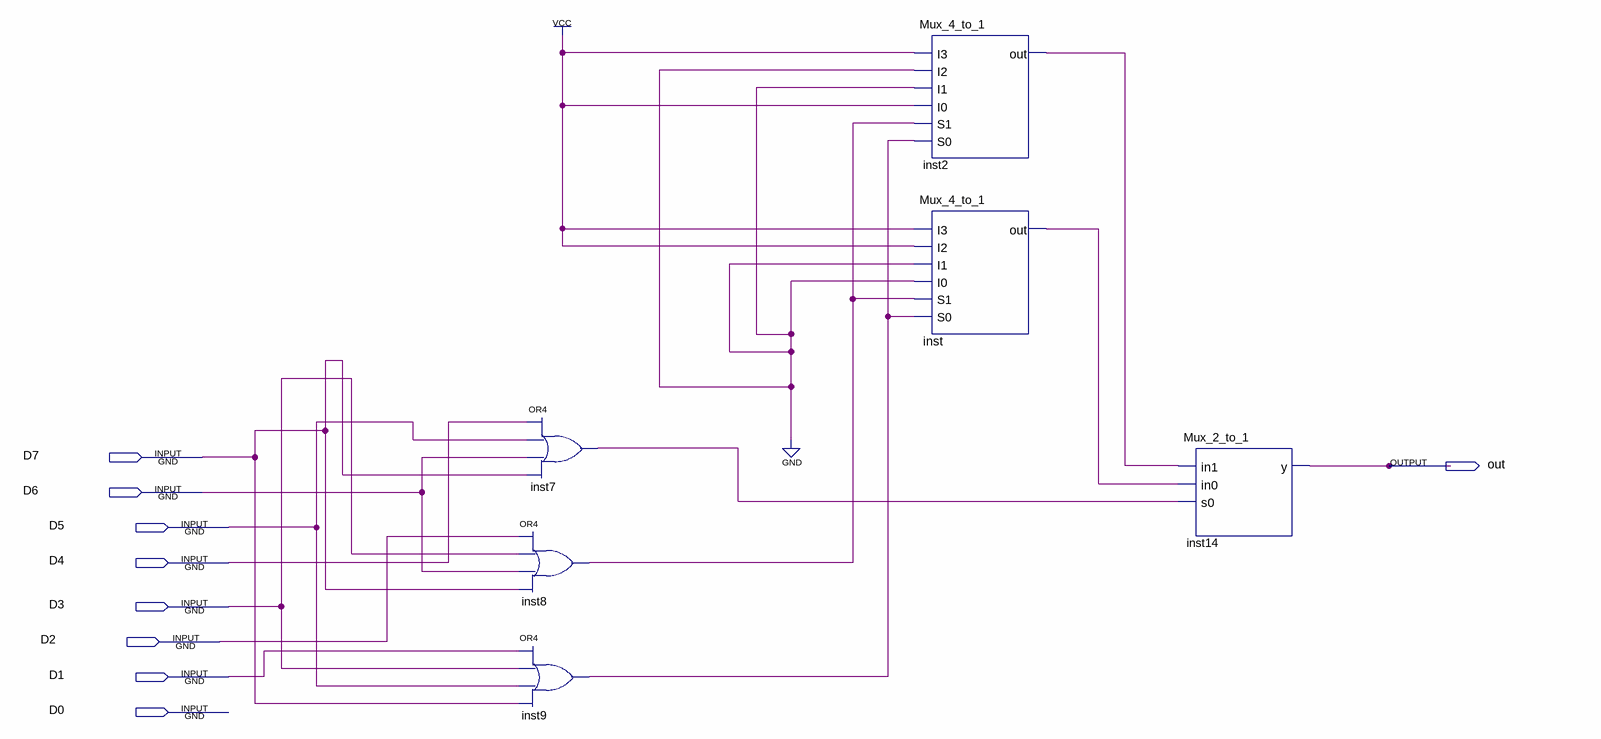
[diagram p0: schematic sheet]
// Quartus schematic comb_ckt.bdf as structural Verilog: 6 symbols, 9 pins
module comb_ckt (
  input  D7,
  input  D6,
  input  D5,
  input  D4,
  input  D3,
  input  D2,
  input  D1,
  input  D0,
  output out
);

  wire inst2_out, inst7_out, inst8_out, inst9_out, inst_out;

  or inst7 (inst7_out, D4, D5, D6, D7);
  or inst8 (inst8_out, D2, D3, D6, D7);
  or inst9 (inst9_out, D1, D3, D5, D7);
  Mux_4_to_1 inst2 (.I3(1'b1), .I2(1'b0), .I1(1'b0), .I0(1'b1), .S1(inst8_out), .S0(inst9_out), .out(inst2_out));
  Mux_4_to_1 inst (.I3(1'b1), .I2(1'b1), .I1(1'b0), .I0(1'b0), .S1(inst8_out), .S0(inst9_out), .out(inst_out));
  Mux_2_to_1 inst14 (.in1(inst2_out), .in0(inst_out), .s0(inst7_out), .y(out));
endmodule
